# Altium schematic sheet Rechaza_bandas.SchDoc
size A; SheetNumber: 4; SheetTotal: 4
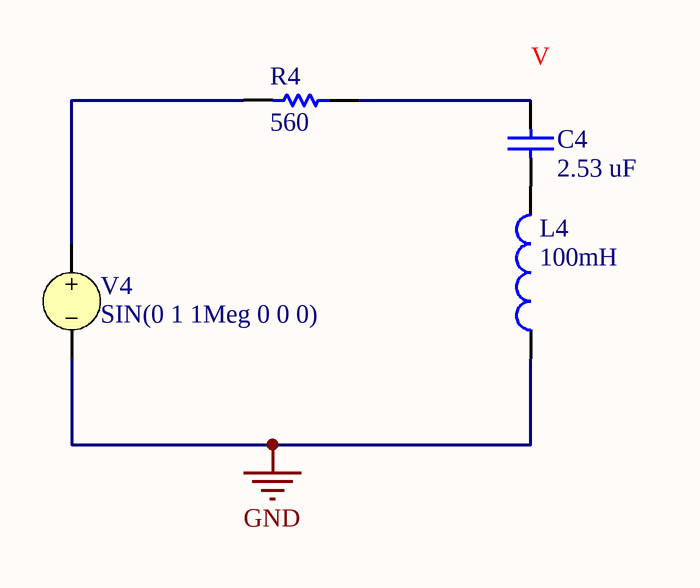
[diagram p0: Rechaza_bandas.SchDoc]

## Parts
C4  value 2.53 uF  (hidden comment: Capacitor)
L4  value 100mH  (hidden comment: Inductor)
R4  value 560  (hidden comment: Resistor)
V4  SIN(0 1 1Meg 0 0 0)

## Nets
GND: L4.1 V4.2
NetC4_1: C4.1 L4.2
NetC4_2: C4.2 R4.1
NetR4_2: R4.2 V4.1

## Library data of the parts
C4 = Capacitor: SimulationGenericComponent: True
L4 = Inductor: SimulationGenericComponent: True
R4 = Resistor: TC1: 0; SimulationGenericComponent: True; TC2: 0
V4 = VSRC: Voltage Source; Note: PCB Footprint - Not required; AC Magnitude: 1; AC Phase: 0; Published: 8-Jun-2000; LatestRevisionDate: 17-Jul-2002; LatestRevisionNote: Re-released for DXP Platform.; PackageReference: Not Applicable; Publisher: Altium Limited; DC Magnitude: 1; Offset: 0; Amplitude: 1; Frequency: 1Meg; Delay: 0; Damping Factor: 0; Phase: 0